# Altium schematic sheet CAN.SchDoc
size A4
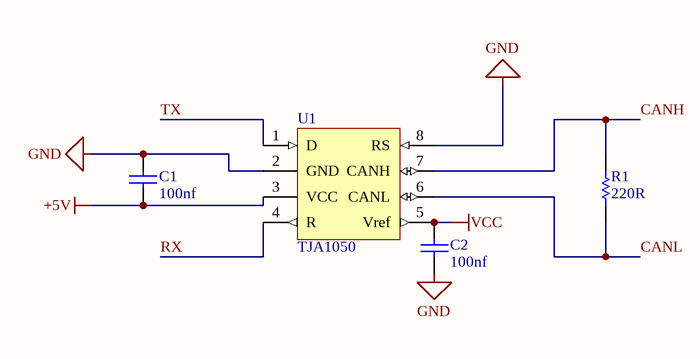
[diagram p0: CAN.SchDoc]

## Parts
C1  100nf  [0603-1]
C2  100nf  [0603-1]
R1  220R  [0603-1]
U1  TJA1050  [SOP8-TJA1050]

## Nets
+5V: C1.1 U1.3(VCC)
GND: C1.2 C2.2 U1.2(GND) U1.8(RS)
VCC: C2.1 U1.5(Vref)
CANH: R1.2 U1.7(CANH)
CANL: R1.1 U1.6(CANL)
RX: U1.4(R)
TX: U1.1(D)

## Library data of the parts
C1 C2 = CAP: Capacitor; Value: 104; Published: 8-Jun-2000; LatestRevisionDate: 17-Jul-2002; LatestRevisionNote: Re-released for DXP Platform.; PackageReference: RAD-0.3; Publisher: Altium Limited
R1 = RES: Resistor; Value: 1K; Published: 8-Jun-2000; Revision: July-2002: Re-released for DXP Platform.; Publisher: Altium Limited